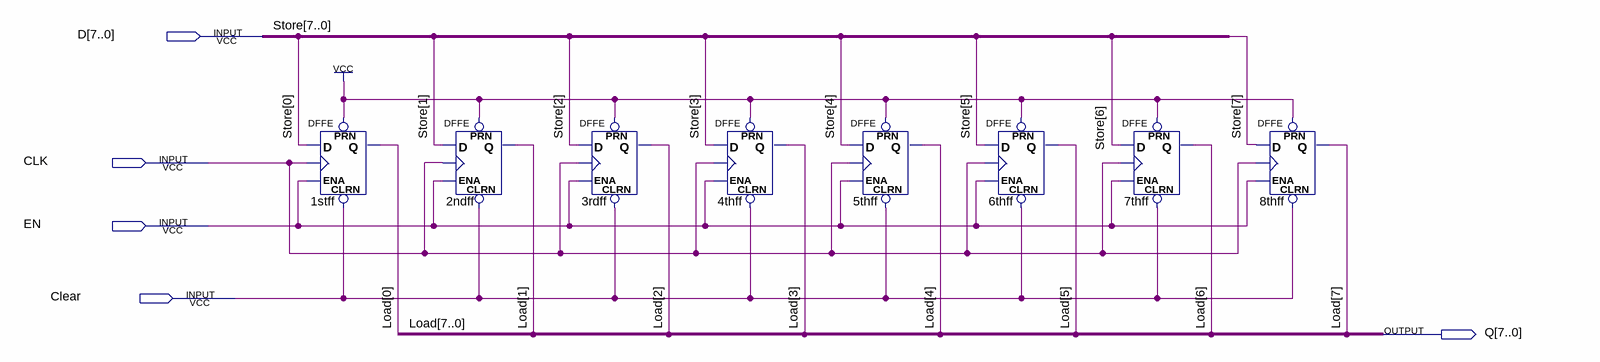
[diagram p0: schematic sheet]
// Quartus schematic Registrador.bdf as structural Verilog: 8 symbols, 5 pins
module Registrador (
  input  [7:0] D,
  input  CLK,
  input  EN,
  input  Clear,
  output [7:0] Q
);

  DFFE u_1stff (.PRN(1'b1), .CLRN(Clear), .D(D[0]), .CLK(CLK), .ENA(EN), .Q(Q[0]));
  DFFE u_2ndff (.PRN(1'b1), .CLRN(Clear), .D(D[1]), .CLK(CLK), .ENA(EN), .Q(Q[1]));
  DFFE u_3rdff (.PRN(1'b1), .CLRN(Clear), .D(D[2]), .CLK(CLK), .ENA(EN), .Q(Q[2]));
  DFFE u_4thff (.PRN(1'b1), .CLRN(Clear), .D(D[3]), .CLK(CLK), .ENA(EN), .Q(Q[3]));
  DFFE u_5thff (.PRN(1'b1), .CLRN(Clear), .D(D[4]), .CLK(CLK), .ENA(EN), .Q(Q[4]));
  DFFE u_6thff (.PRN(1'b1), .CLRN(Clear), .D(D[5]), .CLK(CLK), .ENA(EN), .Q(Q[5]));
  DFFE u_7thff (.PRN(1'b1), .CLRN(Clear), .D(D[6]), .CLK(CLK), .ENA(EN), .Q(Q[6]));
  DFFE u_8thff (.PRN(1'b1), .CLRN(Clear), .D(D[7]), .CLK(CLK), .ENA(EN), .Q(Q[7]));

  // Other names for the same wires on the sheet: Store[7:0] = D; Load[7:0] = Q
endmodule
